# EAGLE design led-matrix-headers (EAGLE 9.1.0)
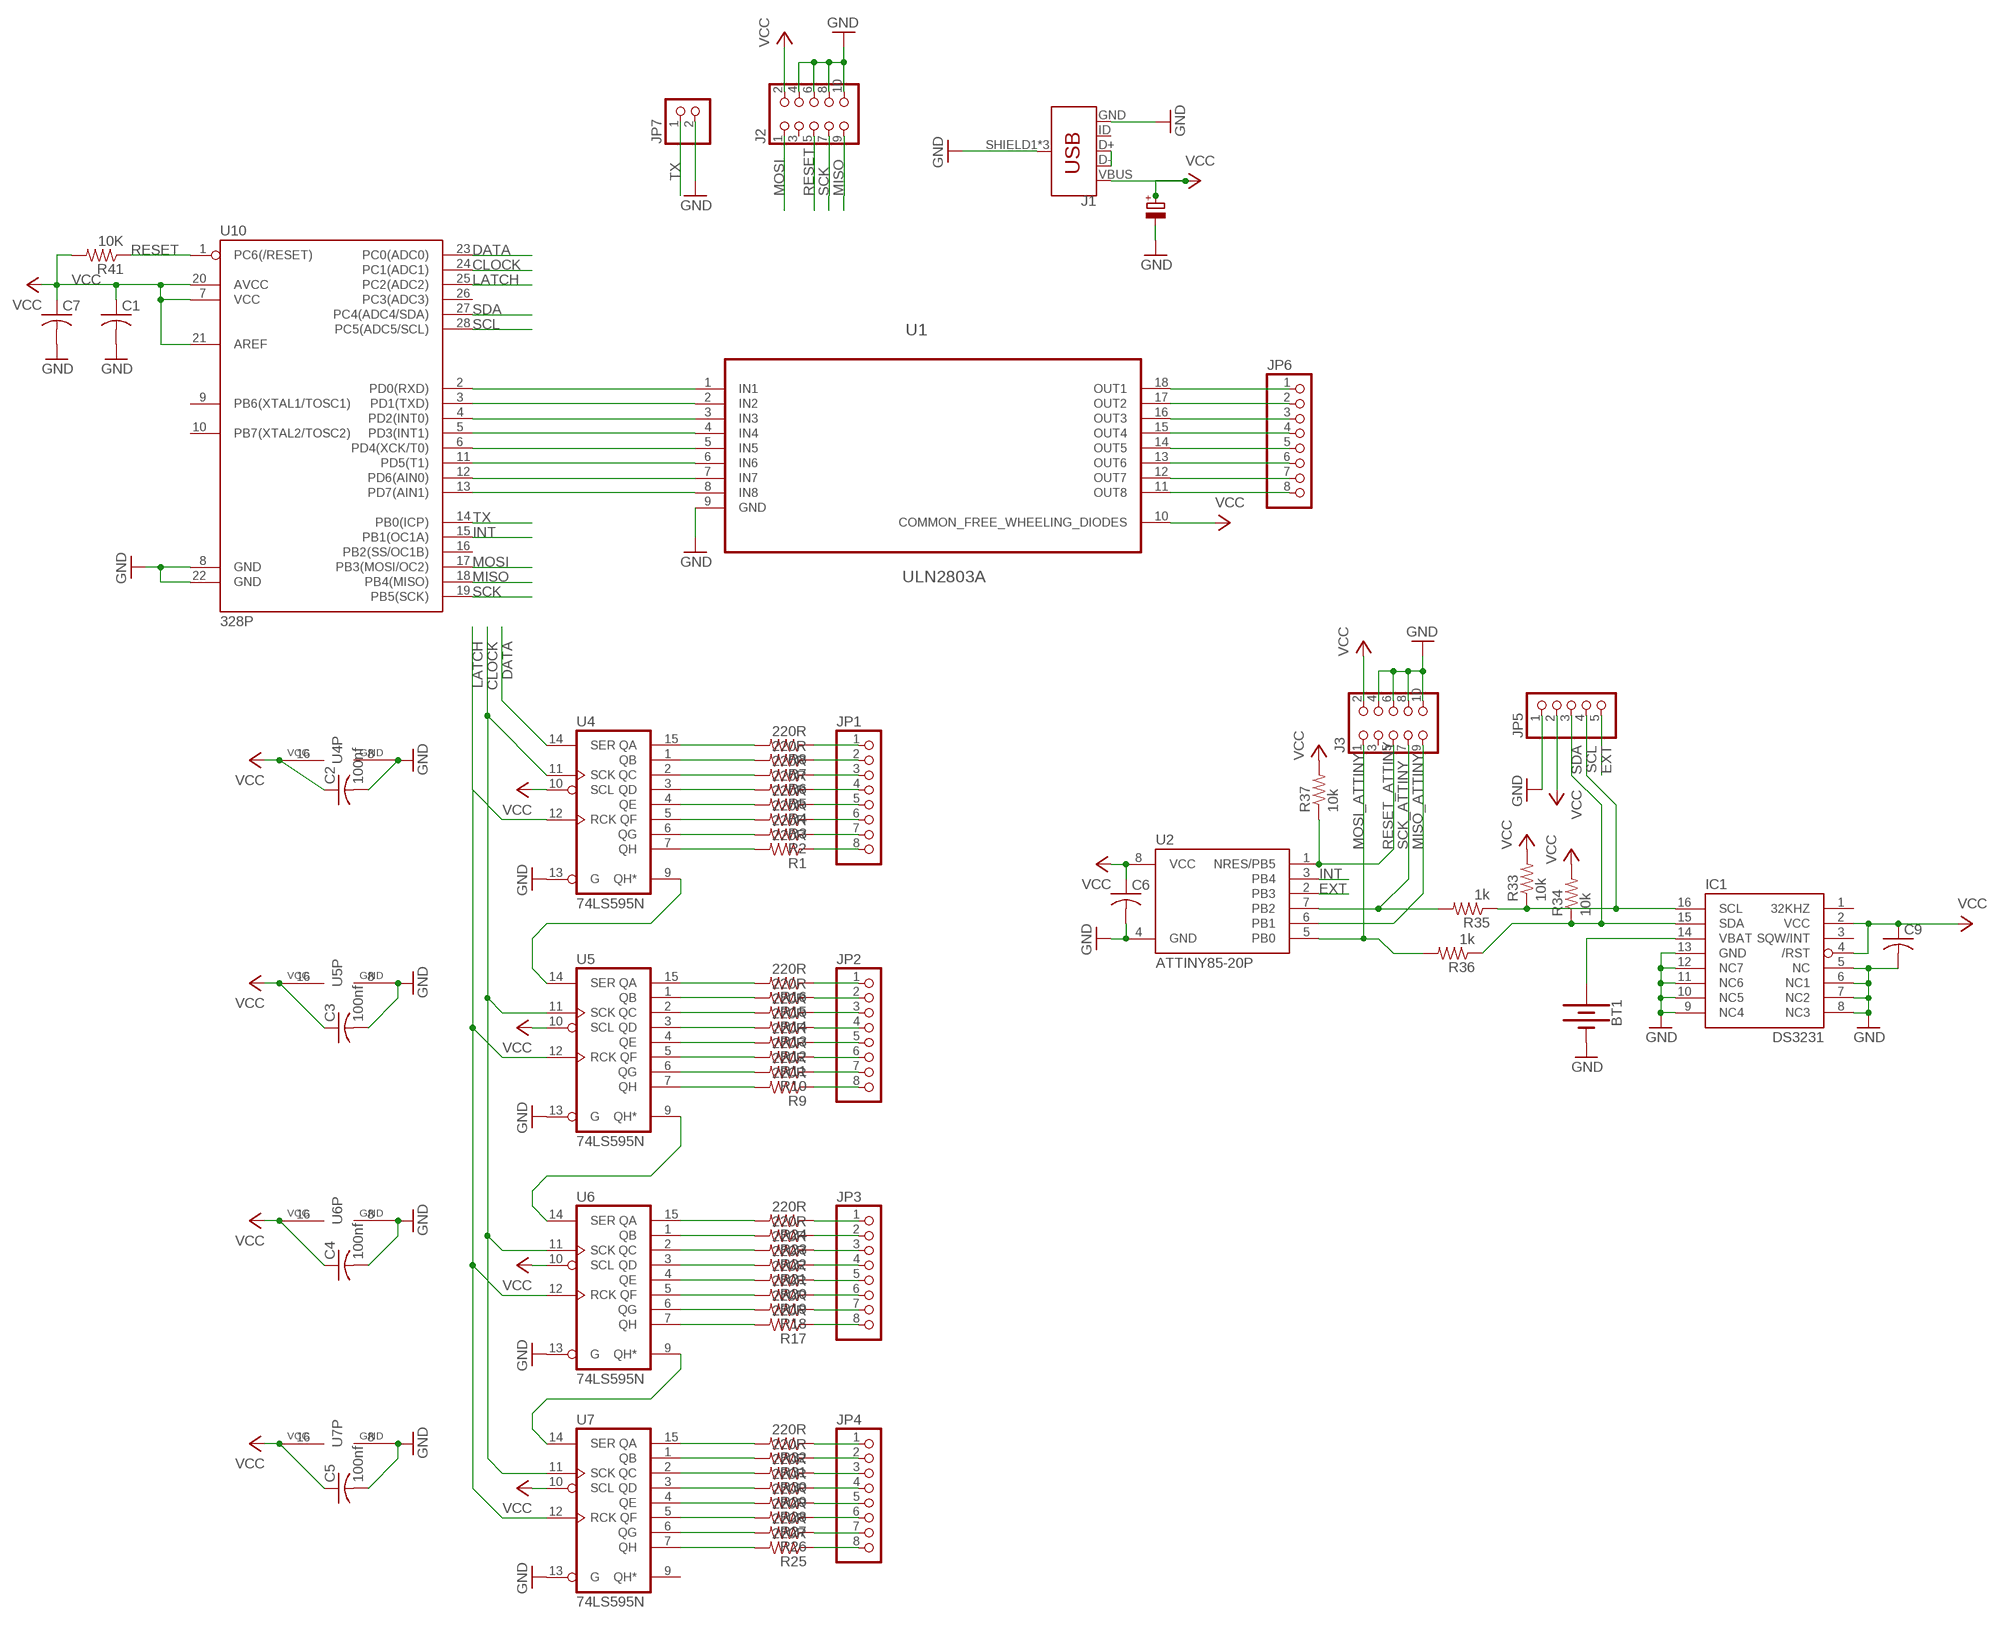
[diagram p0: schematic, sheet 1]

## Parts
BT1  BATTERY-20MM_PTH  [BATTCOM_20MM_PTH]
C1  C-US025-025X050  [C025-025X050]
C2  100nf  C-US025-025X050  [C025-025X050]
C3  100nf  C-US025-025X050  [C025-025X050]
C4  100nf  C-US025-025X050  [C025-025X050]
C5  100nf  C-US025-025X050  [C025-025X050]
C6  C-US025-024X044  [C025-024X044]
C7  C-US025-025X050  [C025-025X050]
C8  10U/35V  [E2-5]
C9  C-US025-024X044  [C025-024X044]
IC1  DS3231/SO  [SO16W]
J1  USB_MICRO-B_FEMALE-SMT  [USB-B-MICRO-SMD]
J2  CON_HEADER_2X05-PTH+SHROUDED_A  [PINSHRD_PTH_2X05]
J3  CON_HEADER_2X05-PTH+SHROUDED_A  [PINSHRD_PTH_2X05]
JP1  PINHD-1X8BIG  [1X08-BIG]
JP2  PINHD-1X8BIG  [1X08-BIG]
JP3  PINHD-1X8BIG  [1X08-BIG]
JP4  PINHD-1X8BIG  [1X08-BIG]
JP5  PINHD-1X5/OCT  [1X05/OCT]
JP6  PINHD-1X8BIG  [1X08-BIG]
JP7  PINHD-1X02_2.54-S  [1X02-S]
R1  220R  R-US_0204/7  [0204/7]
R2  220R  R-US_0204/7  [0204/7]
R3  220R  R-US_0204/7  [0204/7]
R4  220R  R-US_0204/7  [0204/7]
R5  220R  R-US_0204/7  [0204/7]
R6  220R  R-US_0204/7  [0204/7]
R7  220R  R-US_0204/7  [0204/7]
R8  220R  R-US_0204/7  [0204/7]
R9  220R  R-US_0204/7  [0204/7]
R10  220R  R-US_0204/7  [0204/7]
R11  220R  R-US_0204/7  [0204/7]
R12  220R  R-US_0204/7  [0204/7]
R13  220R  R-US_0204/7  [0204/7]
R14  220R  R-US_0204/7  [0204/7]
R15  220R  R-US_0204/7  [0204/7]
R16  220R  R-US_0204/7  [0204/7]
R17  220R  R-US_0204/7  [0204/7]
R18  220R  R-US_0204/7  [0204/7]
R19  220R  R-US_0204/7  [0204/7]
R20  220R  R-US_0204/7  [0204/7]
R21  220R  R-US_0204/7  [0204/7]
R22  220R  R-US_0204/7  [0204/7]
R23  220R  R-US_0204/7  [0204/7]
R24  220R  R-US_0204/7  [0204/7]
R25  220R  R-US_0204/7  [0204/7]
R26  220R  R-US_0204/7  [0204/7]
R27  220R  R-US_0204/7  [0204/7]
R28  220R  R-US_0204/7  [0204/7]
R29  220R  R-US_0204/7  [0204/7]
R30  220R  R-US_0204/7  [0204/7]
R31  220R  R-US_0204/7  [0204/7]
R32  220R  R-US_0204/7  [0204/7]
R33  10k  R-US_0204/7  [0204/7]
R34  10k  R-US_0204/7  [0204/7]
R35  1k  R-US_0204/7  [0204/7]
R36  1k  R-US_0204/7  [0204/7]
R37  10k  R-US_0204/7  [0204/7]
R41  10K  R-US_0204/7  [0204/7]
U1  ULN2803A  [DIP254P762X393-18]
U2  ATTINY85-20P  [PDIP08_300MIL]
U4  74LS595N  [DIL16]
U5  74LS595N  [DIL16]
U6  74LS595N  [DIL16]
U7  74LS595N  [DIL16]
U10  328P  ATMEGA328P_PDIP  [DIP28]

## Nets
CLOCK: U4.11(SCK) U5.11(SCK) U6.11(SCK) U7.11(SCK) U10.24(PC1(ADC1))
DATA: U4.14(SER) U10.23(PC0(ADC0))
EXT: JP5.5 U2.2(PB3)
GND: BT1.2(-) C1.2 C2.2 C3.2 C4.2 C5.2 C6.2 C7.2 C8.- C9.2 IC1.5(NC) IC1.6(NC1) IC1.7(NC2) IC1.8(NC3) IC1.9(NC4) IC1.10(NC5) IC1.11(NC6) IC1.12(NC7) IC1.13(GND) J1.GND J1.SHIELD1(SHIELD) J1.SHIELD2(SHIELD) J1.SHIELD3(SHIELD) J2.4 J2.6 J2.8 J2.10 J3.4 J3.6 J3.8 J3.10 JP5.1 JP7.2 U1.9(GND) U2.4(GND) U4.8(GND) U4.13(G) U5.8(GND) U5.13(G) U6.8(GND) U6.13(G) U7.8(GND) U7.13(G) U10.8(GND) U10.22(GND)
INT: U2.3(PB4) U10.15(PB1(OC1A))
LATCH: U4.12(RCK) U5.12(RCK) U6.12(RCK) U7.12(RCK) U10.25(PC2(ADC2))
MISO: J2.9 U10.18(PB4(MISO))
MISO_ATTINY: J3.9 U2.6(PB1)
MOSI: J2.1 U10.17(PB3(MOSI/OC2))
MOSI_ATTINY: J3.1 R36.2 U2.5(PB0)
N$1: JP1.8 R1.1
N$2: JP1.7 R2.1
N$3: JP1.6 R3.1
N$4: JP1.5 R4.1
N$5: JP1.4 R5.1
N$6: JP1.3 R6.1
N$7: JP1.2 R7.1
N$8: JP1.1 R8.1
N$9: JP2.8 R9.1
N$10: JP2.7 R10.1
N$11: JP2.6 R11.1
N$12: JP2.5 R12.1
N$13: JP2.4 R13.1
N$14: JP2.3 R14.1
N$15: JP2.2 R15.1
N$16: JP2.1 R16.1
N$17: JP3.8 R17.1
N$18: JP3.7 R18.1
N$19: JP3.6 R19.1
N$20: JP3.5 R20.1
N$21: JP3.4 R21.1
N$22: JP3.3 R22.1
N$23: JP3.2 R23.1
N$24: JP3.1 R24.1
N$25: JP4.8 R25.1
N$26: JP4.7 R26.1
N$27: JP4.6 R27.1
N$28: JP4.5 R28.1
N$29: JP4.4 R29.1
N$30: JP4.3 R30.1
N$31: JP4.2 R31.1
N$32: JP4.1 R32.1
N$35: BT1.1(+) IC1.14(VBAT)
N$41: JP6.1 U1.18(OUT1)
N$42: JP6.2 U1.17(OUT2)
N$43: JP6.3 U1.16(OUT3)
N$44: JP6.4 U1.15(OUT4)
N$45: JP6.5 U1.14(OUT5)
N$46: JP6.6 U1.13(OUT6)
N$47: JP6.7 U1.12(OUT7)
N$48: JP6.8 U1.11(OUT8)
N$49: R1.2 U4.7(QH)
N$50: R2.2 U4.6(QG)
N$51: R3.2 U4.5(QF)
N$52: R4.2 U4.4(QE)
N$53: R5.2 U4.3(QD)
N$54: R6.2 U4.2(QC)
N$55: R7.2 U4.1(QB)
N$56: R8.2 U4.15(QA)
N$65: R25.2 U7.7(QH)
N$66: R26.2 U7.6(QG)
N$67: R27.2 U7.5(QF)
N$68: R28.2 U7.4(QE)
N$69: R29.2 U7.3(QD)
N$70: R30.2 U7.2(QC)
N$71: R31.2 U7.1(QB)
N$72: R32.2 U7.15(QA)
N$73: R17.2 U6.7(QH)
N$74: R18.2 U6.6(QG)
N$75: R19.2 U6.5(QF)
N$76: R20.2 U6.4(QE)
N$77: R21.2 U6.3(QD)
N$78: R22.2 U6.2(QC)
N$79: R23.2 U6.1(QB)
N$80: R24.2 U6.15(QA)
N$81: R9.2 U5.7(QH)
N$82: R10.2 U5.6(QG)
N$83: R11.2 U5.5(QF)
N$84: R12.2 U5.4(QE)
N$85: R13.2 U5.3(QD)
N$86: R14.2 U5.2(QC)
N$87: R15.2 U5.1(QB)
N$88: R16.2 U5.15(QA)
N$89: U4.9(QH*) U5.14(SER)
N$90: U5.9(QH*) U6.14(SER)
N$91: U6.9(QH*) U7.14(SER)
N$93: U1.1(IN1) U10.2(PD0(RXD))
N$94: U1.2(IN2) U10.3(PD1(TXD))
N$95: U1.3(IN3) U10.4(PD2(INT0))
N$96: U1.4(IN4) U10.5(PD3(INT1))
N$97: U1.5(IN5) U10.6(PD4(XCK/T0))
N$98: U1.6(IN6) U10.11(PD5(T1))
N$99: U1.7(IN7) U10.12(PD6(AIN0))
N$100: U1.8(IN8) U10.13(PD7(AIN1))
RESET: J2.5 R41.1 U10.1(PC6(/RESET))
RESET_ATTINY: J3.5 R37.1 U2.1(NRES/PB5)
SCK: J2.7 U10.19(PB5(SCK))
SCK_ATTINY: J3.7 R35.2 U2.7(PB2)
SCL: IC1.16(SCL) JP5.4 R33.1 R35.1 U10.28(PC5(ADC5/SCL))
SDA: IC1.15(SDA) JP5.3 R34.1 R36.1 U10.27(PC4(ADC4/SDA))
TX: JP7.1 U10.14(PB0(ICP))
USB-DATA: J1.D+ J1.D-
VCC: C1.1 C2.1 C3.1 C4.1 C5.1 C6.1 C7.1 C8.+ C9.1 IC1.2(VCC) IC1.4(/RST) J1.VBUS J2.2 J3.2 JP5.2 R33.2 R34.2 R37.2 R41.2 U1.10(COMMON_FREE_WHEELING_DIODES) U2.8(VCC) U4.10(SCL) U4.16(VCC) U5.10(SCL) U5.16(VCC) U6.10(SCL) U6.16(VCC) U7.10(SCL) U7.16(VCC) U10.7(VCC) U10.20(AVCC) U10.21(AREF)
Unconnected: IC1.1(32KHZ) IC1.3(SQW/INT) J1.ID J2.3 J3.3 U7.9(QH*) U10.9(PB6(XTAL1/TOSC1)) U10.10(PB7(XTAL2/TOSC2)) U10.16(PB2(SS/OC1B)) U10.26(PC3(ADC3))

## Library data of the parts
BT1 = SparkFun-Batteries:BATTERY: Battery - Single Cell A variety of battery chemistries, sizes, and footprints. Device List: 20MM_PTH - Coin Cell Battery Holder - 20mm (PTH) <https://www.sparkfun.com/products/783> 20MM_PTH_KIT- Coin Cell battery Holder - 20 mm (PTH) <http://www.sparkfun.com/products/783>kit version with special mask 6.8MM_PTH - Coin Cell Battery Holder - 6.8MM(SMD) <https://www.digikey.com/product-detail/en/seiko-instruments/MS621FE-FL11E/728-1057-ND/1889208?WT.srch=1&gclid=CNOQ5a6LzdQCFZS2wAodXCkE0g> 12MM_SMD - Coin Cell Battery Holder - 12mm (SMD) <https://www.sparkfun.com/products/10592> 12MM_PTH - Coin Cell Battery Holder - 12mm (PTH) <https://www.sparkfun.com/products/7948> 20MM_SMD - 20mm Coin Cell Battery Holder (SMD) (2 legs) Used on the Big Time Watch Kit <https://www.sparkfun.com/products/11734> 20MM_SMD_4LEGS - Coin Cell Battery Holder - 20mm (SMD) <https://www.sparkfun.com/products/11892> 20MM_SMD_4LEGS_OVERPASTE - Coin Cell Battery Holder - 20mm (SMD) <https://www.sparkfun.com/products/11892> (Over-paste on the legs) 24.5MM_PTH - Coin Cell Battery Holder - 24.5mm (PTH) <https://www.sparkfun.com/products/8863> 9V - 9V Battery Holder - PC Mount Used on the SparkFun SparkPunk Sound Kit <https://www.sparkfun.com/products/11177> and SparkFun SparkPunk Sequencer Kit <https://www.sparkfun.com/products/12707> 18650 - Battery Holder - 18650 (PTH) <https://www.sparkfun.com/products/13113> AA - Battery Holder - 1xAA (PTH) <https://www.sparkfun.com/products/7949> AAA - Battery Holder - 1xAAA (PTH) <https://www.sparkfun.com/products/12718> AA_KIT - Battery Holder - 1xAA (PTH) <https://www.sparkfun.com/products/7949> Special kit package - pads only have exposed copper on one side of the board. AAA_KIT - Battery Holder - 1xAAA (PTH) <https://www.sparkfun.com/products/12718> Special kit package - pads only have exposed copper on one side of the board.; PROD_ID: BATT-09031; SF_SKU: PRT-00783
C1 C3-C7 C9 = rcl:C-US: CAPACITOR, American symbol
C2 = rcl:C-US: CAPACITOR, American symbol; SPICEPREFIX: C
C8 = capacitors-electrolytic:?; MOUSER: 647-USW1V100MDD
IC1 = adafruit:DS3231
J1 = SparkFun-Connectors:USB_MICRO-B: USB Type Micro-B Connector Male/female and PTH/SMT variants SparkFun Products: SparkFun microB USB Breakout <https://www.sparkfun.com/products/12035> SparkFun USB microB Plug Breakout <https://www.sparkfun.com/products/10031> SparkFun ESP8266 Thing <https://www.sparkfun.com/products/13231>; PROD_ID: CONN-11752
J2 J3 = dp_devices.v6:CON_HEADER_2X05: 2x05 pin header
JP1-JP4 JP6 = adafruit:PINHD-1X8: PIN HEADER
JP5 = pinhead_v2:PINHD-1X5: PIN HEADER
JP7 = pinhead-2:PINHD-1X02: PIN HEADER
R1-R37 R41 = rcl:R-US_: RESISTOR, American symbol
U1 = ST Microelctronics_By_element14_Batch_1:ULN2803A: EIGHT DARLINGTON ARRAYS; MPN: ULN2803A; OC_FARNELL: 1094428; OC_NEWARK: 89K1143; PACKAGE: 18-DIP; SUPPLIER: STMICROELECTRONICS
U2 = _hhn_attiny25_45_85:ATTINY85*: ATMEL ATtiny 85 Packages: P = PDIP 08 30mil S = SOIC 08 EIAJ 208mil Technologies Note: for complete ordering code (temp. range, finish, tape&reel etc.) see www.atmel.com • Supply Voltage: V = (1.8…5.5)V | [blank] = (2.7…5.5)V • Speed: 10 = 10 MHz | 20 = 20 MHz Author: Dipl.-Ing. FH Rainer Bayer HHN Hochschule Heilbronn (Heilbronn University), rainer.bayer@hs-heilbronn.de Ingenieurbüro ing-rb, mail@ing-rb.de
U4 = 74xx-us:74*595: 8-bit SHIFT REGISTER, output latch; SPICEPREFIX: B
U5-U7 = 74xx-us:74*595: 8-bit SHIFT REGISTER, output latch
U10 = SparkFun-IC-Microcontroller:ATMEGA328P_PDIP: Atmel 328P Through hole ATMEGA328P uC used in the Arduino 32kb flash, 1k EEPROM, 2k SRAM Datasheet <http://www.sparkfun.com/datasheets/Components/SMD/ATMega328.pdf> SparkFun Products Storefront component: AVR 28 Pin 20MHz 32K 6A/D - ATMega328P <https://www.sparkfun.com/products/9061> (COM-09061) SparkFun Simon Says - Through-Hole Soldering Kit <https://www.sparkfun.com/products/10547> (KIT-10547) SparkFun Learn to Solder - Simon Says <https://www.sparkfun.com/products/13708> (KIT-13708) SparkFun BigTime Watch Kit <https://www.sparkfun.com/products/11734> (KIT-11734) SparkFun ClockIt <https://www.sparkfun.com/products/10930> (KIT-10930) SparkFun Serial Enabled LCD Kit <https://www.sparkfun.com/products/10097> (LCD-10097) SparkFun Simon Tilts - Through Hole Soldering Kit <https://www.sparkfun.com/products/12634> (KIT-12634) SparkFun Frequency Counter Kit <https://www.sparkfun.com/products/10140> (KIT-10140) FabFM Radio Kit <https://www.sparkfun.com/products/11043> (KIT-11043) SparkFun Binary Blaster Kit <https://www.sparkfun.com/products/12037> (KIT-12037) SparkFun Metro-Gnome <https://www.sparkfun.com/products/9236> (KIT-09236) ATmega328 with Arduino Optiboot (Uno) <https://www.sparkfun.com/products/10524> (DEV-10524); PROD_ID: IC-09136

## Board
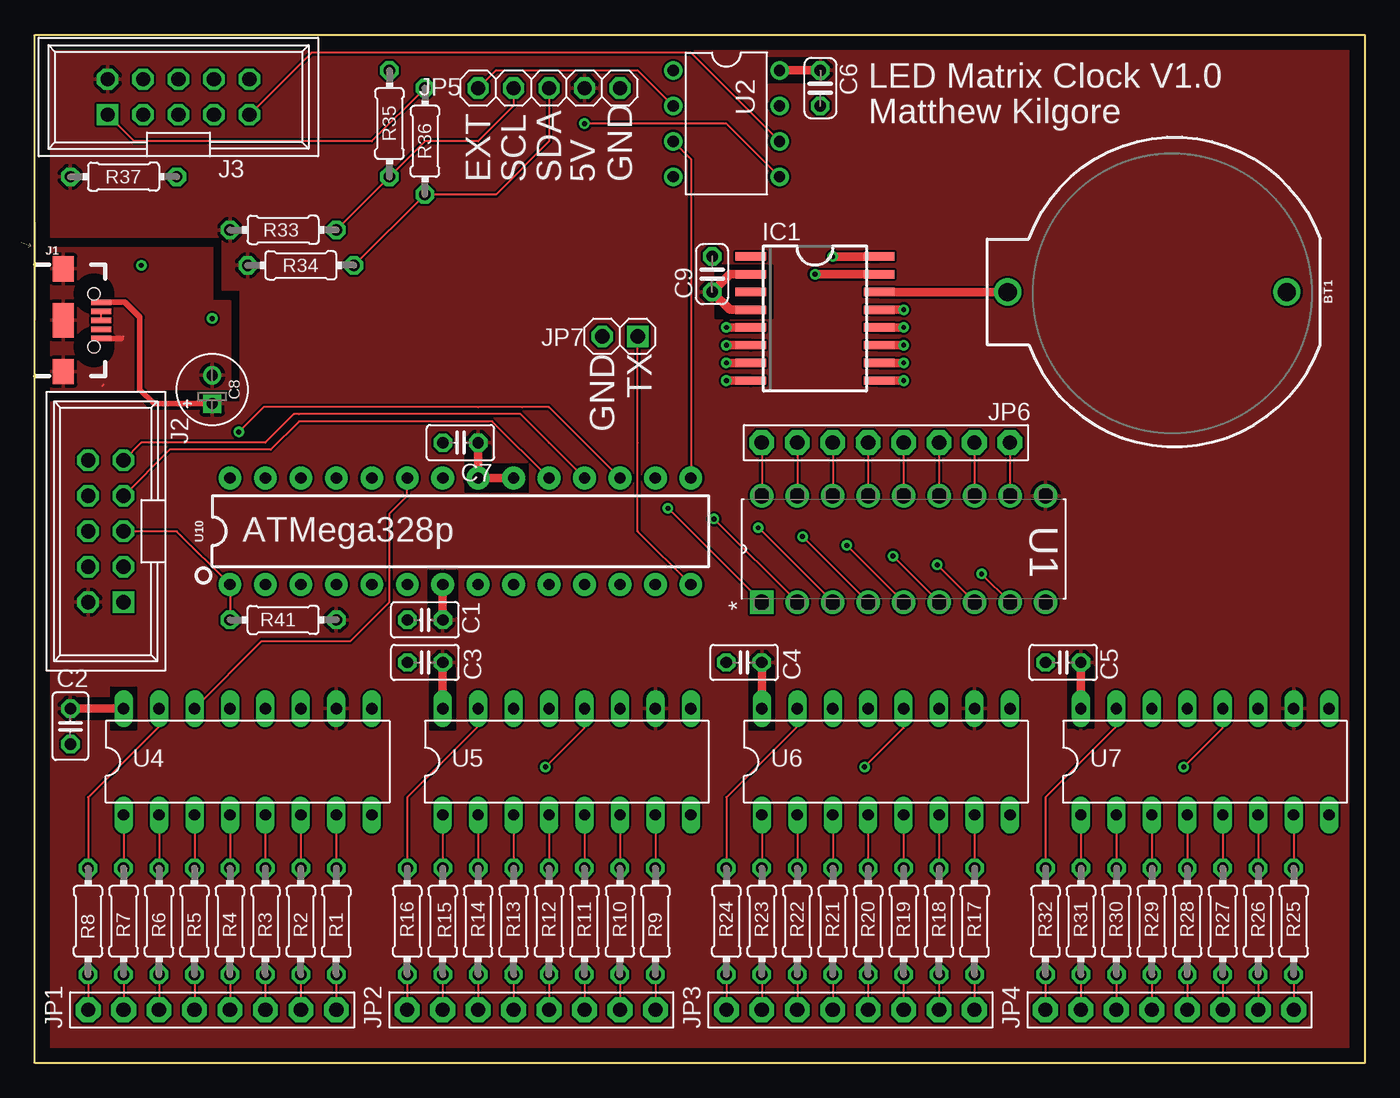
[diagram p1: board, top side]
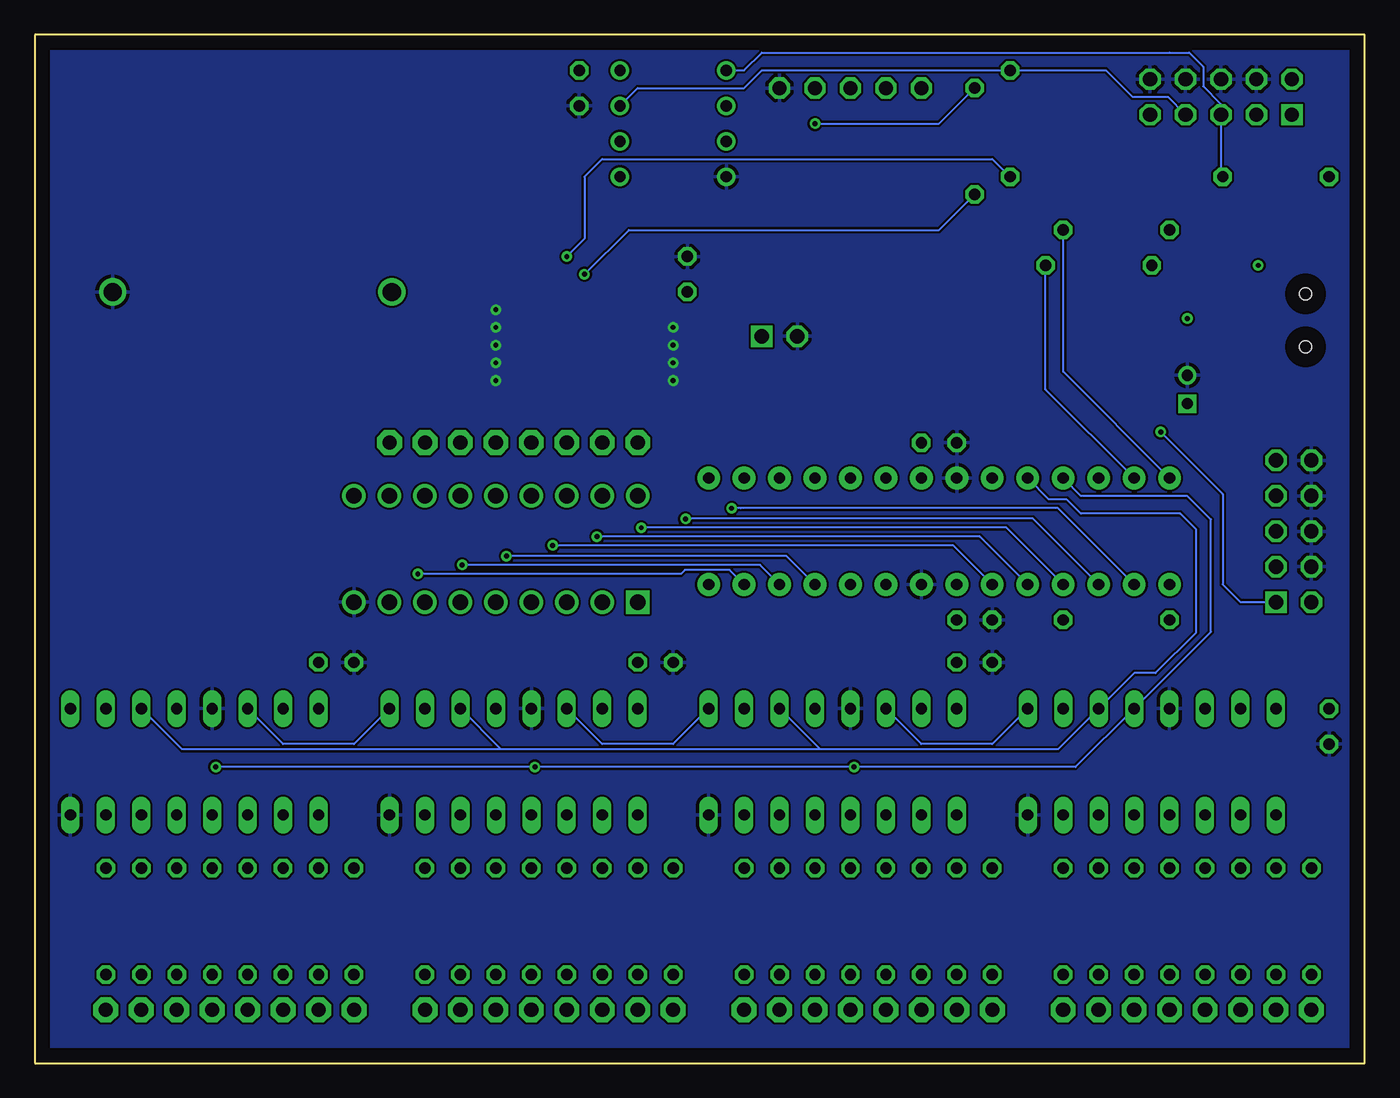
[diagram p2: board, bottom side, seen from below]

Size 95.25 x 73.66 mm. Coordinates in mm from the lower left corner, seen from the top.
Outline: 0,0 0,73.66 95.25,73.66 95.25,0 0,0
Copper layers (1*16): Top 0.035mm / dielectric 1.5mm / Bottom 0.035mm
Design rules "default": minimum track width 6mil, minimum drill 0.35mm, track to track 6mil, track to pad 6mil, pad to pad 6mil, via to via 6mil, smd to smd 6mil, copper to edge 40mil, drill to drill 6mil, minimum pad ring 10mil, minimum via ring 8mil, stop-mask expansion 4mil, vias tented up to drill 0mil, thermal gap 10mil

### Footprints (pad centres in the part's own frame; a part is rotated, then mirrored left to right if it is on the bottom)
BATTCOM_20MM_PTH = drill 1.3: 1 11.85,0; 2 -8.15,0
C025-025X050 = drill 0.813 octagon: 1 -1.27,0; 2 1.27,0
C025-024X044 = drill 0.813 octagon: 1 -1.27,0; 2 1.27,0
E2-5 = drill 0.813 square: + -1.016,0 | drill 0.813: - 1.016,0
SO16W = smd 0.6 x 2.2: 1 -4.445,-4.6; 2 -3.175,-4.6; 3 -1.905,-4.6; 4 -0.635,-4.6; 5 0.635,-4.6; 6 1.905,-4.6; 7 3.175,-4.6; 8 4.445,-4.6; 9 4.445,4.6; 10 3.175,4.6; 11 1.905,4.6; 12 0.635,4.6; 13 -0.635,4.6; 14 -1.905,4.6; 15 -3.175,4.6; 16 -4.445,4.6
USB-B-MICRO-SMD = smd 1.45 x 0.4: D+ 2.725,0; D- 2.725,0.65; GND 2.725,-1.3; ID 2.725,-0.65; VBUS 2.725,1.3 | smd 1.5 x 1.8: SHIELD1 0,3.685; SHIELD2 0,-3.685 | smd 1.5 x 2.5: SHIELD3 0,0 | hole 0.85: 2.2,1.9; 2.2,-1.9
PINSHRD_PTH_2X05 = drill 1.016 square: 1 -5.08,-1.27 | drill 1.016 octagon: 2 -5.08,1.27; 3 -2.54,-1.27; 4 -2.54,1.27; 5 0,-1.27; 6 0,1.27; 7 2.54,-1.27; 8 2.54,1.27; 9 5.08,-1.27; 10 5.08,1.27
1X08-BIG = drill 1.016 pad 1.778 octagon: 1 -8.89,0; 2 -6.35,0; 3 -3.81,0; 4 -1.27,0; 5 1.27,0; 6 3.81,0; 7 6.35,0; 8 8.89,0
1X05/OCT = drill 1.016 octagon: 1 -5.08,0; 2 -2.54,0; 3 0,0; 4 2.54,0; 5 5.08,0
1X02-S = drill 1.016 square: 1 -1.27,0 | drill 1.016 octagon: 2 1.27,0
0204/7 = drill 0.813 octagon: 1 -3.81,0; 2 3.81,0
DIP254P762X393-18 = drill 1.118 square: 1 -7.62,20.32 | drill 1.118: 2 -7.62,17.78; 3 -7.62,15.24; 4 -7.62,12.7; 5 -7.62,10.16; 6 -7.62,7.62; 7 -7.62,5.08; 8 -7.62,2.54; 9 -7.62,0; 10 0,0; 11 0,2.54; 12 0,5.08; 13 0,7.62; 14 0,10.16; 15 0,12.7; 16 0,15.24; 17 0,17.78; 18 0,20.32
PDIP08_300MIL = drill 0.813: 1 -3.81,-3.81; 2 -1.27,-3.81; 3 1.27,-3.81; 4 3.81,-3.81; 5 3.81,3.81; 6 1.27,3.81; 7 -1.27,3.81; 8 -3.81,3.81
DIL16 = drill 0.813 long: 1 -8.89,-3.81; 2 -6.35,-3.81; 3 -3.81,-3.81; 4 -1.27,-3.81; 5 1.27,-3.81; 6 3.81,-3.81; 7 6.35,-3.81; 8 8.89,-3.81; 9 8.89,3.81; 10 6.35,3.81; 11 3.81,3.81; 12 1.27,3.81; 13 -1.27,3.81; 14 -3.81,3.81; 15 -6.35,3.81; 16 -8.89,3.81
DIP28 = drill 0.813 pad 1.626: 1 -16.51,-3.81; 2 -13.97,-3.81; 3 -11.43,-3.81; 4 -8.89,-3.81; 5 -6.35,-3.81; 6 -3.81,-3.81; 7 -1.27,-3.81; 8 1.27,-3.81; 9 3.81,-3.81; 10 6.35,-3.81; 11 8.89,-3.81; 12 11.43,-3.81; 13 13.97,-3.81; 14 16.51,-3.81; 15 16.51,3.81; 16 13.97,3.81; 17 11.43,3.81; 18 8.89,3.81; 19 6.35,3.81; 20 3.81,3.81; 21 1.27,3.81; 22 -1.27,3.81; 23 -3.81,3.81; 24 -6.35,3.81; 25 -8.89,3.81; 26 -11.43,3.81; 27 -13.97,3.81; 28 -16.51,3.81

### Placement (x,y rotation side)
BT1  81.53,55.24 180 top
C1  27.94,31.75 180 top
C2  2.54,24.13 270 top
C3  27.94,28.7 180 top
C4  50.8,28.7 180 top
C5  73.66,28.7 180 top
C6  56.26,69.85 270 top
C7  30.48,44.45 180 top
C8  12.7,48.26 90 top
C9  48.51,56.52 90 top
IC1  55.88,53.34 270 top
J1  2.03,53.21 0 top
J2  5.08,38.1 90 top
J3  10.29,69.22 0 top
JP1  12.7,3.81 0 top
JP2  35.56,3.81 0 top
JP3  58.42,3.81 0 top
JP4  81.28,3.81 0 top
JP5  36.83,69.85 180 top
JP6  60.96,44.45 0 top
JP7  41.91,52.07 180 top
R1  21.59,10.16 90 top
R2  19.05,10.16 90 top
R3  16.51,10.16 90 top
R4  13.97,10.16 90 top
R5  11.43,10.16 90 top
R6  8.89,10.16 90 top
R7  6.35,10.16 90 top
R8  3.81,10.16 90 top
R9  44.45,10.16 90 top
R10  41.91,10.16 90 top
R11  39.37,10.16 90 top
R12  36.83,10.16 90 top
R13  34.29,10.16 90 top
R14  31.75,10.16 90 top
R15  29.21,10.16 90 top
R16  26.67,10.16 90 top
R17  67.31,10.16 90 top
R18  64.77,10.16 90 top
R19  62.23,10.16 90 top
R20  59.69,10.16 90 top
R21  57.15,10.16 90 top
R22  54.61,10.16 90 top
R23  52.07,10.16 90 top
R24  49.53,10.16 90 top
R25  90.17,10.16 90 top
R26  87.63,10.16 90 top
R27  85.09,10.16 90 top
R28  82.55,10.16 90 top
R29  80.01,10.16 90 top
R30  77.47,10.16 90 top
R31  74.93,10.16 90 top
R32  72.39,10.16 90 top
R33  17.78,59.69 180 top
R34  19.05,57.15 180 top
R35  25.4,67.31 90 top
R36  27.94,66.04 90 top
R37  6.35,63.5 180 top
R41  17.78,31.75 0 top
U1  72.39,40.64 90 top
U2  49.53,67.31 270 top
U4  15.24,21.59 0 top
U5  38.1,21.59 0 top
U6  60.96,21.59 0 top
U7  83.82,21.59 0 top
U10  30.48,38.1 0 top

### Tracks (layer width: path | path; a pad name or v marks a point on that pad's centre or on a via)
BLAH
  cutout Top: 48.77,53.34 48.77,57.15 52.83,57.15 52.83,53.34
CLOCK
  Bottom 0.152: 61.85,22.48 U6.11 | 61.85,22.48 84.71,22.48 85.09,22.86 U7.11 | 38.99,22.48 21.97,22.48 U4.11 16.51,27.94 14.99,27.94 12.06,30.86 12.06,38.23 13.21,39.37 20.32,39.37 21.34,40.39 22.61,40.39 U10.24 | 38.99,22.48 U5.11 | 38.99,22.48 61.85,22.48
DATA
  Top 0.152: U4.14 16.26,30.23 22.61,30.23 25.4,33.02 25.4,39.37 26.67,40.64 U10.23
EXT
  Top 0.152: JP5.5 33.02,71.12 43.18,71.12 U2.2
GND  (via drill 0.35)
  Top 0.152: 12.6,49.33 C8.- | 4.92,48.61 4.83,48.51 | 6.19,51.91 6.35,52.07
  Top 0.406: J1.GND 6.19,51.91
  Top 0.61: IC1.5 v49.53,52.7 | IC1.6 v49.53,51.44 | IC1.7 v49.53,50.16 | IC1.8 v49.53,48.9 | IC1.13 v62.23,53.98 | IC1.12 v62.23,52.7 | IC1.11 v62.23,51.44 | IC1.10 v62.23,50.16 | IC1.9 v62.23,48.9
  pour Top: 0,58.42 12.7,58.42 12.7,54.61 13.97,54.61 13.97,48.26 0,48.26
  pour Bottom: 0,73.66 95.25,73.66 95.25,0 0,0
  cutout Top: 28.45,28.32 30.1,28.32 30.1,23.88 28.32,23.88 28.32,28.32
  cutout Top: 28.19,35.31 30.23,35.31 30.23,32 28.19,32
  cutout Top: 7.24,26.92 7.24,23.88 5.46,23.88 5.46,24.64 2.79,24.64 2.79,26.16 5.46,26.16 5.46,26.92
  cutout Top: 51.18,28.45 52.96,28.45 52.96,23.88 51.18,23.88
  cutout Top: 74.04,28.45 75.82,28.45 75.82,24 74.04,24
  cutout Top: 30.86,40.89 30.86,44.2 32.64,44.2 32.64,42.93 35.31,42.93 35.31,40.89 32.64,40.89
  cutout Top: 52.45,70.23 52.45,72.01 56.01,72.01 56.01,70.23
INT
  Top 0.152: U2.3 46.99,64.77 U10.15
LATCH  (via drill 0.35)
  Top 0.152: v59.44,21.21 62.23,24 U6.12 | v36.58,21.21 39.37,24 U5.12 | v82.3,21.21 85.09,24 U7.12
  Bottom 0.152: v82.3,21.21 v59.44,21.21 v36.58,21.21 20.7,21.21 U4.12 11.01,30.9 11.01,38.95 12.7,40.64 20.32,40.64 U10.25
MISO
  Top 0.152: U10.18 36.83,44.45 34.8,46.48 18.92,46.48 18.54,46.48 16.51,44.45 7.62,44.45 J2.9
MISO_ATTINY
  Top 0.152: U2.6 46.99,72.39 19.81,72.39 J3.9
MOSI  (via drill 0.35)
  Top 0.152: U10.17 36.83,46.99 34.92,46.99 31.75,46.99 16.38,46.99 14.73,45.34 v14.61,45.21
  Bottom 0.152: v14.61,45.21 10.16,40.77 10.16,34.29 8.89,33.02 J2.1
MOSI_ATTINY  (via drill 0.35)
  Top 0.152: U2.5 49.53,67.31 v39.37,67.31 | R36.2 24.13,66.04 7.11,66.04 J3.1
  Bottom 0.152: v39.37,67.31 30.48,67.31 R36.2
N$1
  Top 0.152: R1.1 JP1.8
N$2
  Top 0.152: R2.1 JP1.7
N$3
  Top 0.152: R3.1 JP1.6
N$4
  Top 0.152: R4.1 JP1.5
N$5
  Top 0.152: R5.1 JP1.4
N$6
  Top 0.152: R6.1 JP1.3
N$7
  Top 0.152: R7.1 JP1.2
N$8
  Top 0.152: R8.1 JP1.1
N$9
  Top 0.152: R9.1 JP2.8
N$10
  Top 0.152: R10.1 JP2.7
N$11
  Top 0.152: R11.1 JP2.6
N$12
  Top 0.152: R12.1 JP2.5
N$13
  Top 0.152: R13.1 JP2.4
N$14
  Top 0.152: R14.1 JP2.3
N$15
  Top 0.152: R15.1 JP2.2
N$16
  Top 0.152: R16.1 JP2.1
N$17
  Top 0.152: R17.1 JP3.8
N$18
  Top 0.152: R18.1 JP3.7
N$19
  Top 0.152: R19.1 JP3.6
N$20
  Top 0.152: R20.1 JP3.5
N$21
  Top 0.152: R21.1 JP3.4
N$22
  Top 0.152: R22.1 JP3.3
N$23
  Top 0.152: R23.1 JP3.2
N$24
  Top 0.152: R24.1 JP3.1
N$25
  Top 0.152: R25.1 JP4.8
N$26
  Top 0.152: R26.1 JP4.7
N$27
  Top 0.152: R27.1 JP4.6
N$28
  Top 0.152: R28.1 JP4.5
N$29
  Top 0.152: R29.1 JP4.4
N$30
  Top 0.152: R30.1 JP4.3
N$31
  Top 0.152: R31.1 JP4.2
N$32
  Top 0.152: R32.1 JP4.1
N$33  (via drill 0.35)
  other vias: 12.7,53.34
N$34  (via drill 0.35)
  other vias: 7.62,57.15
N$35
  Top 0.61: IC1.14 BT1.1
N$41
  Top 0.152: JP6.1 U1.18
N$42
  Top 0.152: JP6.2 U1.17
N$43
  Top 0.152: JP6.3 U1.16
N$44
  Top 0.152: JP6.4 U1.15
N$45
  Top 0.152: JP6.5 U1.14
N$46
  Top 0.152: JP6.6 U1.13
N$47
  Top 0.152: JP6.7 U1.12
N$48
  Top 0.152: JP6.8 U1.11
N$49
  Top 0.152: U4.7 R1.2
N$50
  Top 0.152: U4.6 R2.2
N$51
  Top 0.152: U4.5 R3.2
N$52
  Top 0.152: U4.4 R4.2
N$53
  Top 0.152: U4.3 R5.2
N$54
  Top 0.152: U4.2 R6.2
N$55
  Top 0.152: U4.1 R7.2
N$56
  Top 0.152: U4.15 8.89,24.13 3.81,19.05 R8.2
N$65
  Top 0.152: U7.7 R25.2
N$66
  Top 0.152: U7.6 R26.2
N$67
  Top 0.152: U7.5 R27.2
N$68
  Top 0.152: U7.4 R28.2
N$69
  Top 0.152: U7.3 R29.2
N$70
  Top 0.152: U7.2 R30.2
N$71
  Top 0.152: U7.1 R31.2
N$72
  Top 0.152: U7.15 77.47,24.13 72.39,19.05 R32.2
N$73
  Top 0.152: U6.7 R17.2
N$74
  Top 0.152: U6.6 R18.2
N$75
  Top 0.152: U6.5 R19.2
N$76
  Top 0.152: U6.4 R20.2
N$77
  Top 0.152: U6.3 R21.2
N$78
  Top 0.152: U6.2 R22.2
N$79
  Top 0.152: U6.1 R23.2
N$80
  Top 0.152: U6.15 54.61,24.13 49.53,19.05 R24.2
N$81
  Top 0.152: U5.7 R9.2
N$82
  Top 0.152: U5.6 R10.2
N$83
  Top 0.152: U5.5 R11.2
N$84
  Top 0.152: U5.4 R12.2
N$85
  Top 0.152: U5.3 R13.2
N$86
  Top 0.152: U5.2 R14.2
N$87
  Top 0.152: U5.1 R15.2
N$88
  Top 0.152: U5.15 31.75,24.13 26.67,19.05 R16.2
N$89
  Bottom 0.152: U4.9 26.67,22.86 31.75,22.86 U5.14
N$90
  Bottom 0.152: U5.9 49.53,22.86 54.61,22.86 U6.14
N$91
  Bottom 0.152: U6.9 72.39,22.86 77.47,22.86 U7.14
N$93  (via drill 0.35)
  Top 0.152: v45.34,39.75 U1.1
  Bottom 0.152: U10.2 21.97,39.75 44.7,39.75 v45.34,39.75
N$94  (via drill 0.35)
  Top 0.152: v48.64,38.99 U1.2
  Bottom 0.152: U10.3 23.78,39.02 48.61,39.02 | 48.61,39.02 v48.64,38.99 48.61,39.02
N$95  (via drill 0.35)
  Top 0.152: v51.82,38.35 U1.3
  Bottom 0.152: U10.4 25.65,38.35 51.69,38.35 v51.82,38.35
N$96  (via drill 0.35)
  Top 0.152: v54.99,37.72 U1.4
  Bottom 0.152: U10.5 27.56,37.72 v54.99,37.72
N$97  (via drill 0.35)
  Top 0.152: v58.17,37.08 U1.5
  Bottom 0.152: U10.6 29.46,37.08 v58.17,37.08
N$98  (via drill 0.35)
  Top 0.152: v61.47,36.32 U1.6
  Bottom 0.152: U10.11 41.4,36.32 v61.47,36.32
N$99  (via drill 0.35)
  Top 0.152: v64.64,35.69 U1.7
  Bottom 0.152: U10.12 43.31,35.69 v64.64,35.69
N$100  (via drill 0.35)
  Top 0.152: v67.82,35.05 U1.8
  Bottom 0.152: v67.82,35.05 48.97,35.05 48.69,35.33 45.49,35.33 U10.13
RESET
  Top 0.152: R41.1 U10.1 10.16,38.1 J2.5
RESET_ATTINY
  Bottom 0.152: R37.1 10.29,63.63 J3.5 10.29,68.71 11.56,69.98 11.56,71.37 12.57,72.39 13.97,72.39 43.18,72.39 44.45,71.12 U2.1
SCK
  Top 0.152: U10.19 32.77,45.97 19.05,45.97 18.92,45.97 16.89,43.94 9.65,43.94 J2.7
SCK_ATTINY
  Bottom 0.152: U2.7 52.07,69.85 44.45,69.85 43.18,71.12 R35.2 18.54,71.12 16.64,69.22 14.1,69.22 J3.7
SCL  (via drill 0.35)
  Top 0.152: R33.1 R35.1 27.94,66.04 31.75,66.04 34.29,68.58 JP5.4
  Top 0.61: v57.15,57.78 IC1.16
  Bottom 0.152: U10.28 21.59,49.53 R33.1 | R35.1 26.67,64.77 54.61,64.77 55.88,63.5 55.88,59.05 v57.15,57.78
SDA  (via drill 0.35)
  Top 0.152: R34.1 R36.1 33.02,62.23 36.83,66.04 JP5.3
  Top 0.61: v55.88,56.52 IC1.15
  Bottom 0.152: U10.27 22.86,48.26 R34.1 | v55.88,56.52 52.7,59.69 30.48,59.69 R36.1
TX
  Top 0.152: U10.14 43.18,38.1 43.18,44.45 JP7.1
USB-DATA
  Top 0.152: J1.D+ J1.D-
VCC
  Top 0.406: J1.VBUS 6.45,54.51 7.52,53.44 7.52,48.26 8.54,47.24 C8.+ | 29.21,33.02
  Top 0.61: C3.1 U5.16 | C1.1 29.21,33.02 U10.7 | C2.1 U4.16 | C4.1 U6.16 | C5.1 U7.16 | C7.1 U10.21 U10.20 | C6.1 U2.8 | IC1.2 49.78,56.52 C9.1 49.78,53.98 IC1.4
  pour Top (rank 2): 0,0 0,47.37 7.62,47.37 8.11,46.74 12.57,46.74 12.57,47.37 14.73,47.37 14.73,55.37 13.46,55.37 13.46,59.18 0,59.18 0,73.66 95.25,73.66 95.25,55.88 95.25,0

### Text on the board
tPlace: LED Matrix Clock V1.0 | Matthew Kilgore | EXT | SCL | SDA | 5V | GND | TX | GND | ATMega328p